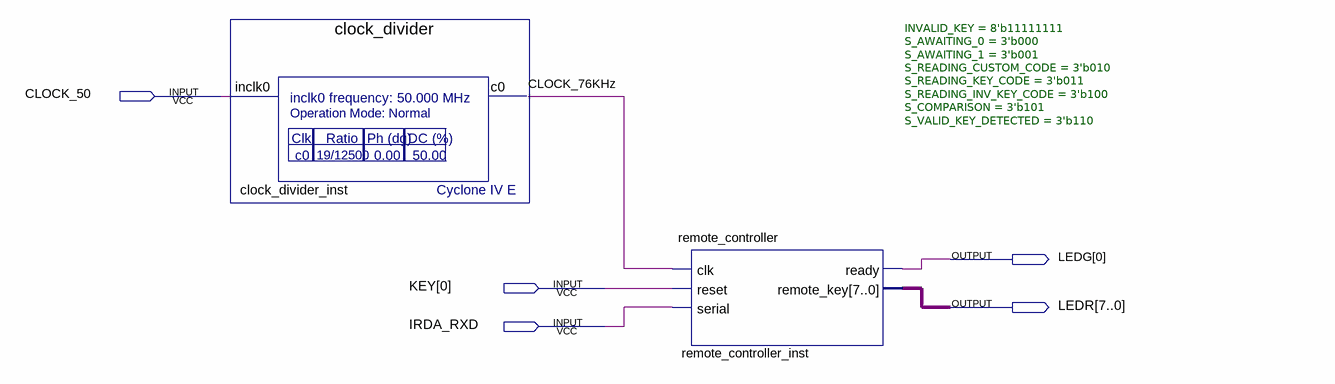
[diagram p0: schematic sheet]
// Quartus schematic RemoteControllerProject.bdf as structural Verilog: 2 symbols, 5 pins
module RemoteControllerProject (
  input  CLOCK_50,
  input  [0:0] KEY,
  input  IRDA_RXD,
  output [0:0] LEDG,
  output [7:0] LEDR
);

  wire CLOCK_76KHz;

  clock_divider clock_divider_inst (.inclk0(CLOCK_50), .c0(CLOCK_76KHz));
  remote_controller #(.INVALID_KEY(8'b11111111), .S_AWAITING_0(3'b000), .S_AWAITING_1(3'b001), .S_READING_CUSTOM_CODE(3'b010), .S_READING_KEY_CODE(3'b011), .S_READING_INV_KEY_CODE(3'b100), .S_COMPARISON(3'b101), .S_VALID_KEY_DETECTED(3'b110)) remote_controller_inst (
    .clk(CLOCK_76KHz), .reset(KEY[0]), .serial(IRDA_RXD), .ready(LEDG[0]), .remote_key(LEDR));
endmodule
